# Altium schematic sheet STM32-Nucleo-144.SchDoc
size A3; SheetNumber: 7; SheetTotal: 11
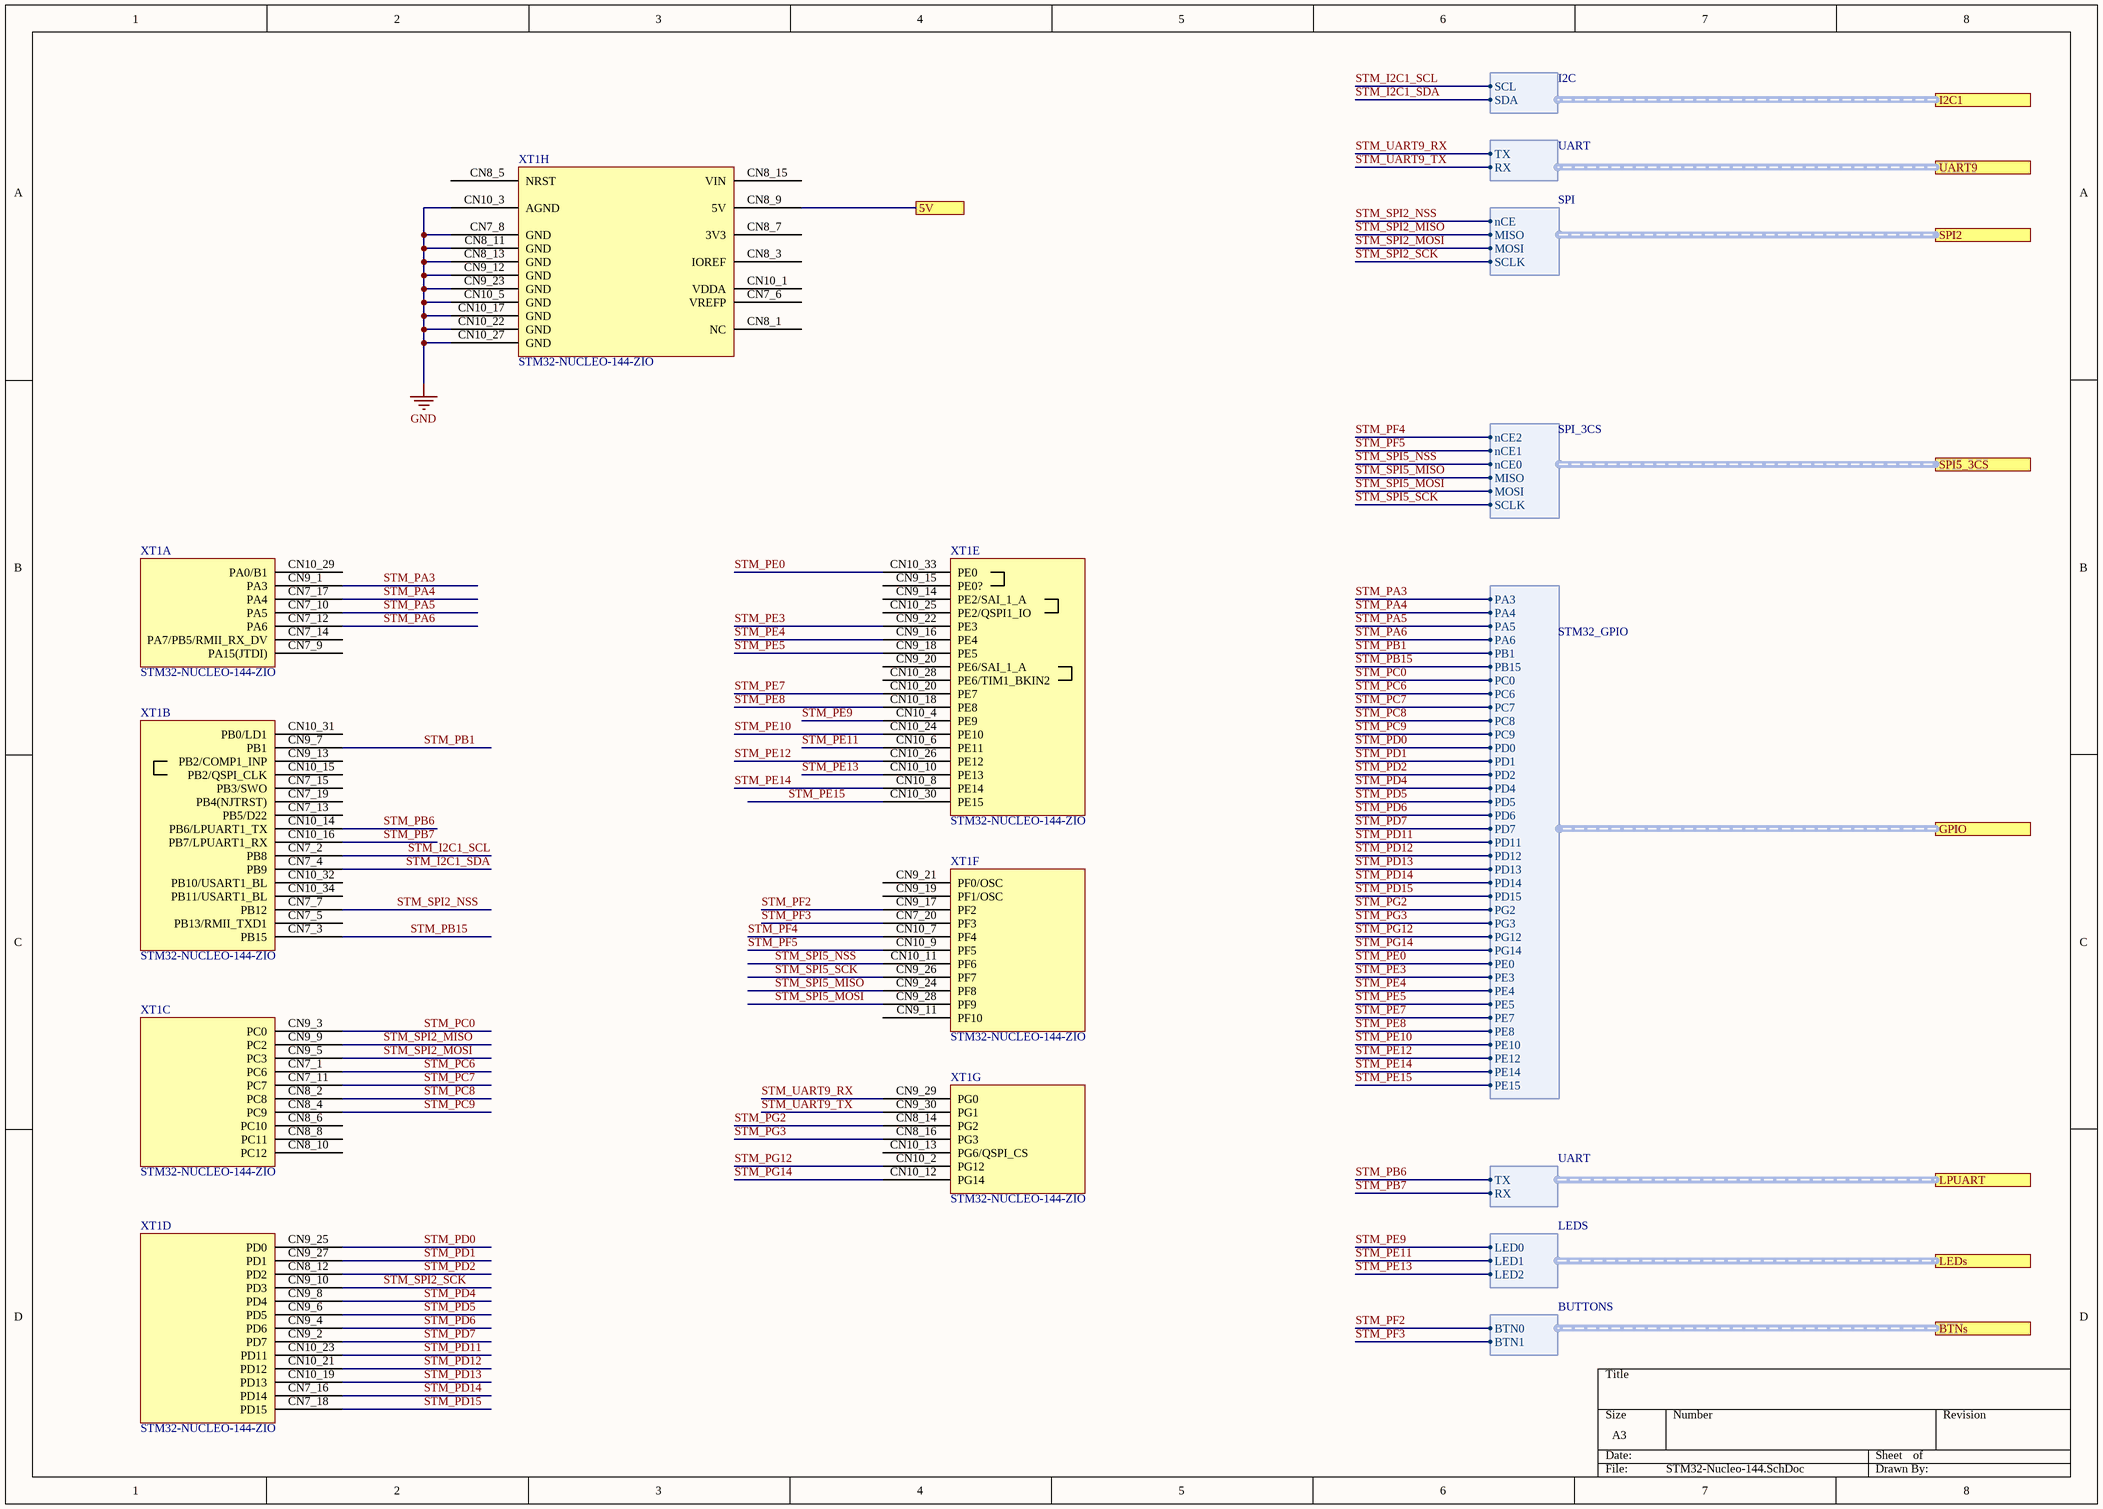
[diagram p0: STM32-Nucleo-144.SchDoc]

## Parts
XT1  STM32-NUCLEO-144-ZIO  [STM32-NUCLEO-144-ZIO]  (parts A,B,C,D,E,F,G,H of 8)

## Ports
5V, BTNs (harness BUTTONS), GPIO (harness STM32_GPIO), I2C1 (harness I2C), LEDs (harness LEDS), LPUART (harness UART), SPI2 (harness SPI), SPI5_3CS (harness SPI_3CS), UART9 (harness UART)

## Harnesses
SPI_3CS: nCE2, nCE1, nCE0, MISO, MOSI, SCLK
I2C: SCL, SDA
UART: TX, RX
SPI: nCE, MISO, MOSI, SCLK
LEDS: LED0, LED1, LED2
BUTTONS: BTN0, BTN1
STM32_GPIO: PB1, PB15, PC0, PC6, PC7, PC8, PC9, PD0, PD1, PD2, PD4, PD5, PD6, PD11, PD12, PD13, PD14, PD15, PG2, PG3, PG12, PG14, PE0, PE3, PE4, PE5, PE7, PE8, PE10, PE12, PE14, PE15, PD7, PA6, PA3, PA4, PA5

## Nets
GND: XT1.CN7_8(GND) XT1.CN8_11(GND) XT1.CN8_13(GND) XT1.CN9_12(GND) XT1.CN9_23(GND) XT1.CN10_3(AGND) XT1.CN10_5(GND) XT1.CN10_17(GND) XT1.CN10_22(GND) XT1.CN10_27(GND)
5V: XT1.CN8_9(5V) ; port 5V
STM_I2C1_SCL: XT1.CN7_2(PB8) ; port I2C1.SCL
STM_I2C1_SDA: XT1.CN7_4(PB9) ; port I2C1.SDA
STM_PA3: XT1.CN9_1(PA3) ; port GPIO.PA3
STM_PA4: XT1.CN7_17(PA4) ; port GPIO.PA4
STM_PA5: XT1.CN7_10(PA5) ; port GPIO.PA5
STM_PA6: XT1.CN7_12(PA6) ; port GPIO.PA6
STM_PB1: XT1.CN9_7(PB1) ; port GPIO.PB1
STM_PB6: XT1.CN10_14(PB6/LPUART1_TX) ; port LPUART.TX
STM_PB7: XT1.CN10_16(PB7/LPUART1_RX) ; port LPUART.RX
STM_PB15: XT1.CN7_3(PB15) ; port GPIO.PB15
STM_PC0: XT1.CN9_3(PC0) ; port GPIO.PC0
STM_PC6: XT1.CN7_1(PC6) ; port GPIO.PC6
STM_PC7: XT1.CN7_11(PC7) ; port GPIO.PC7
STM_PC8: XT1.CN8_2(PC8) ; port GPIO.PC8
STM_PC9: XT1.CN8_4(PC9) ; port GPIO.PC9
STM_PD0: XT1.CN9_25(PD0) ; port GPIO.PD0
STM_PD1: XT1.CN9_27(PD1) ; port GPIO.PD1
STM_PD2: XT1.CN8_12(PD2) ; port GPIO.PD2
STM_PD4: XT1.CN9_8(PD4) ; port GPIO.PD4
STM_PD5: XT1.CN9_6(PD5) ; port GPIO.PD5
STM_PD6: XT1.CN9_4(PD6) ; port GPIO.PD6
STM_PD7: XT1.CN9_2(PD7) ; port GPIO.PD7
STM_PD11: XT1.CN10_23(PD11) ; port GPIO.PD11
STM_PD12: XT1.CN10_21(PD12) ; port GPIO.PD12
STM_PD13: XT1.CN10_19(PD13) ; port GPIO.PD13
STM_PD14: XT1.CN7_16(PD14) ; port GPIO.PD14
STM_PD15: XT1.CN7_18(PD15) ; port GPIO.PD15
STM_PE0: XT1.CN10_33(PE0) ; port GPIO.PE0
STM_PE3: XT1.CN9_22(PE3) ; port GPIO.PE3
STM_PE4: XT1.CN9_16(PE4) ; port GPIO.PE4
STM_PE5: XT1.CN9_18(PE5) ; port GPIO.PE5
STM_PE7: XT1.CN10_20(PE7) ; port GPIO.PE7
STM_PE8: XT1.CN10_18(PE8) ; port GPIO.PE8
STM_PE9: XT1.CN10_4(PE9) ; port LEDs.LED0
STM_PE10: XT1.CN10_24(PE10) ; port GPIO.PE10
STM_PE11: XT1.CN10_6(PE11) ; port LEDs.LED1
STM_PE12: XT1.CN10_26(PE12) ; port GPIO.PE12
STM_PE13: XT1.CN10_10(PE13) ; port LEDs.LED2
STM_PE14: XT1.CN10_8(PE14) ; port GPIO.PE14
STM_PE15: XT1.CN10_30(PE15) ; port GPIO.PE15
STM_PF2: XT1.CN9_17(PF2) ; port BTNs.BTN0
STM_PF3: XT1.CN7_20(PF3) ; port BTNs.BTN1
STM_PF4: XT1.CN10_7(PF4) ; port SPI5_3CS.nCE2
STM_PF5: XT1.CN10_9(PF5) ; port SPI5_3CS.nCE1
STM_PG2: XT1.CN8_14(PG2) ; port GPIO.PG2
STM_PG3: XT1.CN8_16(PG3) ; port GPIO.PG3
STM_PG12: XT1.CN10_2(PG12) ; port GPIO.PG12
STM_PG14: XT1.CN10_12(PG14) ; port GPIO.PG14
STM_SPI2_MISO: XT1.CN9_9(PC2) ; port SPI2.MISO
STM_SPI2_MOSI: XT1.CN9_5(PC3) ; port SPI2.MOSI
STM_SPI2_NSS: XT1.CN7_7(PB12) ; port SPI2.nCE
STM_SPI2_SCK: XT1.CN9_10(PD3) ; port SPI2.SCLK
STM_SPI5_MISO: XT1.CN9_24(PF8) ; port SPI5_3CS.MISO
STM_SPI5_MOSI: XT1.CN9_28(PF9) ; port SPI5_3CS.MOSI
STM_SPI5_NSS: XT1.CN10_11(PF6) ; port SPI5_3CS.nCE0
STM_SPI5_SCK: XT1.CN9_26(PF7) ; port SPI5_3CS.SCLK
STM_UART9_RX: XT1.CN9_29(PG0) ; port UART9.TX
STM_UART9_TX: XT1.CN9_30(PG1) ; port UART9.RX

Not connected (* = marked no-connect by the designer): XT1 CN7_5(PB13/RMII_TXD1) CN7_6(VREFP) CN7_9(PA15(JTDI)) CN7_13(PB5/D22) CN7_14(PA7/PB5/RMII_RX_DV) CN7_15(PB3/SWO) CN7_19(PB4(NJTRST)) CN8_1(NC) CN8_3(IOREF) CN8_5(NRST) CN8_6(PC10) CN8_7(3V3) CN8_8(PC11) CN8_10(PC12) CN8_15(VIN) CN9_11(PF10) CN9_13(PB2/COMP1_INP) CN9_14(PE2/SAI_1_A) CN9_15(PE0?) CN9_19(PF1/OSC) CN9_20(PE6/SAI_1_A) CN9_21(PF0/OSC) CN10_1(VDDA) CN10_13(PG6/QSPI_CS) CN10_15(PB2/QSPI_CLK) CN10_25(PE2/QSPI1_IO) CN10_28(PE6/TIM1_BKIN2) CN10_29(PA0/B1) CN10_31(PB0/LD1) CN10_32(PB10/USART1_BL) CN10_34(PB11/USART1_BL)